# Altium schematic sheet MCU.SchDoc
size A3; SheetNumber: 2; SheetTotal: 4
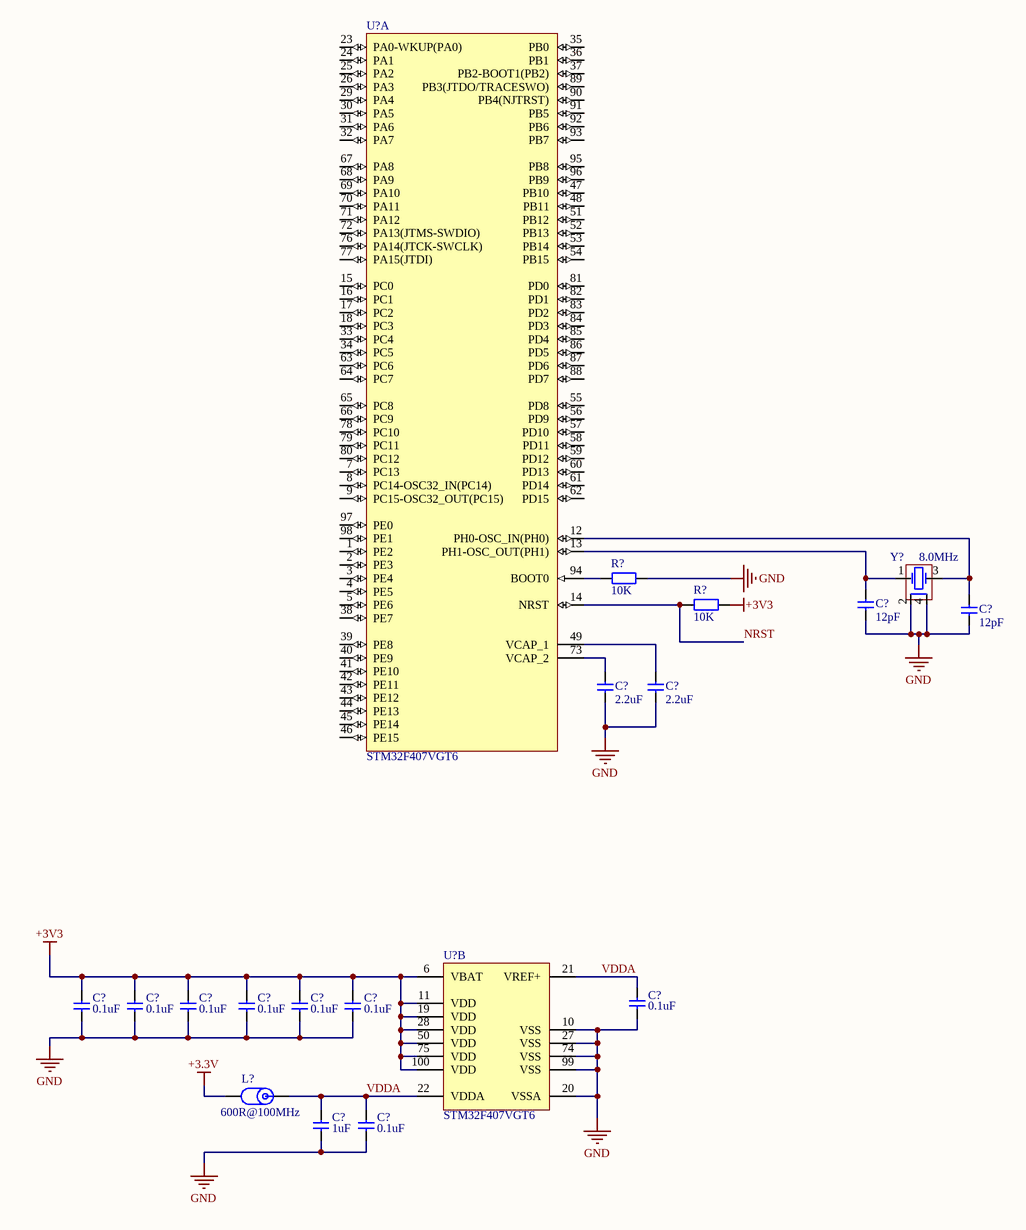
[diagram p0: MCU.SchDoc]

## Parts
(Parts that share a designator on the sheet are numbered #1, #2 ... from top to bottom, then left to right.)
C?#1  12pF  [CAP0603]
C?#2  12pF  [CAP0603]
C?#3  2.2uF  [CAP0603]
C?#4  2.2uF  [CAP0603]
C?#5  0.1uF  [CAP0603]
C?#6  0.1uF  [CAP0603]
C?#7  0.1uF  [CAP0603]
C?#8  0.1uF  [CAP0603]
C?#9  0.1uF  [CAP0603]
C?#10  0.1uF  [CAP0603]
C?#11  0.1uF  [CAP0603]
C?#12  1uF  [CAP0603]
C?#13  0.1uF  [CAP0603]
L?  600R@100MHz  [FERRITE 0603]
R?#1  10K  [RES0603]
R?#2  10K  [RES0603]
U?#1  STM32F407VGT6  [LQFP100]  (part A of 2)
U?#2  STM32F407VGT6  [LQFP100]  (part B of 2)
Y?  8.0MHz  [TSX-3225]

## Nets
+3.3V: L?.1
+3V3: C?#5.2 C?#6.2 C?#7.2 C?#8.2 C?#9.2 C?#10.2 R?#2.2 U?#2.6(VBAT) U?#2.11(VDD) U?#2.19(VDD) U?#2.28(VDD) U?#2.50(VDD) U?#2.75(VDD) U?#2.100(VDD)
GND: C?#1.1 C?#2.1 C?#3.1 C?#4.1 C?#5.1 C?#6.1 C?#7.1 C?#8.1 C?#9.1 C?#10.1 C?#11.1 C?#12.1 C?#13.1 R?#1.2 U?#2.10(VSS) U?#2.20(VSSA) U?#2.27(VSS) U?#2.74(VSS) U?#2.99(VSS) Y?.2 Y?.4
NRST: R?#2.1 U?#1.14(NRST)
VDDA: C?#11.2 C?#12.2 C?#13.2 L?.2 U?#2.21(VREF+) U?#2.22(VDDA)
NetC?#1_2: C?#1.2 U?#1.13(PH1-OSC_OUT(PH1)) Y?.1
NetC?#2_2: C?#2.2 U?#1.12(PH0-OSC_IN(PH0)) Y?.3
NetC?#3_2: C?#3.2 U?#1.73(VCAP_2)
NetC?#4_2: C?#4.2 U?#1.49(VCAP_1)
NetR?#1_1: R?#1.1 U?#1.94(BOOT0)

Not connected (* = marked no-connect by the designer): U?#1 1(PE2) 2(PE3) 3(PE4) 4(PE5) 5(PE6) 7(PC13) 8(PC14-OSC32_IN(PC14)) 9(PC15-OSC32_OUT(PC15)) 15(PC0) 16(PC1) 17(PC2) 18(PC3) 23(PA0-WKUP(PA0)) 24(PA1) 25(PA2) 26(PA3) 29(PA4) 30(PA5) 31(PA6) 32(PA7) 33(PC4) 34(PC5) 35(PB0) 36(PB1) 37(PB2-BOOT1(PB2)) 38(PE7) 39(PE8) 40(PE9) 41(PE10) 42(PE11) 43(PE12) 44(PE13) 45(PE14) 46(PE15) 47(PB10) 48(PB11) 51(PB12) 52(PB13) 53(PB14) 54(PB15) 55(PD8) 56(PD9) 57(PD10) 58(PD11) 59(PD12) 60(PD13) 61(PD14) 62(PD15) 63(PC6) 64(PC7) 65(PC8) 66(PC9) 67(PA8) 68(PA9) 69(PA10) 70(PA11) 71(PA12) 72(PA13(JTMS-SWDIO)) 76(PA14(JTCK-SWCLK)) 77(PA15(JTDI)) 78(PC10) 79(PC11) 80(PC12) 81(PD0) 82(PD1) 83(PD2) 84(PD3) 85(PD4) 86(PD5) 87(PD6) 88(PD7) 89(PB3(JTDO/TRACESWO)) 90(PB4(NJTRST)) 91(PB5) 92(PB6) 93(PB7) 95(PB8) 96(PB9) 97(PE0) 98(PE1)

## Library data of the parts
C?#1-C?#13 = CAP Ceramic: Ceramic SMD Cap
L? = Ferrite Bead: BLM18DN601SH1D / https://www.chipdip.ru/product/blm18dn601sh1d-ferrit-busina-imped-100mgts-600om-smd-murata-8033530814
R?#1 R?#2 = RES: RES smd
U?#1 U?#2 = STM32F407VGT6: ARM Cortex-M4 32-bit MCU+FPU, 210 DMIPS, 1024 kB Flash, 192 kB Internal RAM, 82 I/Os, 100-pin LQFP, -40 to 85 degC, Tray; Manufacturer: STMicroelectronics; D/A Converter: 2x12-bit; FLASH Size (Prog) (kB): 1024; I/Os (High Current): 82; Internal RAM Size (kB): 192; Operating Frequency(F) (Processor speed) (MHz): 168; Supply Voltage(Vcc) max (V): 3.6; Supply Voltage(Vcc) min (V): 1.8; DatasheetVersion: Rev. 4; PackageVersion: Rev. 1, 06/2013; PackageReference: LQFP100; PackageDescription: 100-Pin Low Profile Quad Flat Package, 14 x 14 mm Body, 0.5 mm Pitch; Supplier 1: Digi-Key; Supplier Part Number 1: 497-11605-ND; Supplier 2: Farnell; Supplier Part Number 2: 2064368; Supplier 3: Newark; Supplier Part Number 3: 73T2333; Supplier 4: Mouser; Supplier Part Number 4: 511-STM32F407VGT6; Core: ARM Cortex-M4; Packing: Tray; Mounting Technology: Surface Mount; PartNumber: STM32F407VGT6; ComponentLink1Description: Manufacturer URL; ComponentLink1URL: http://www.st.com/web/en/home.html; ComponentLink2Description: Datasheet; ComponentLink2URL: http://www.st.com/st-web-ui/static/active/en/resource/technical/document/datasheet/DM00037051.pdf; ComponentLink3Description: Package Specification; ComponentLink3URL: http://www.st.com/st-web-ui/static/active/en/resource/technical/document/data_brief/DM00071938.pdf
Y? = Quartz